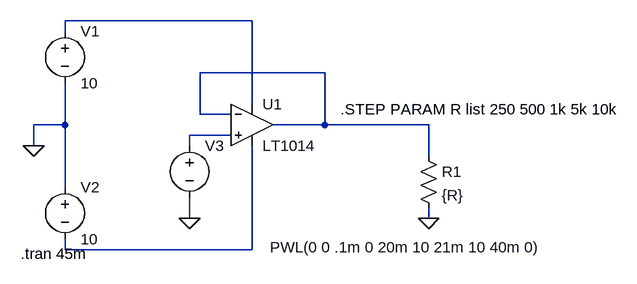
[diagram p0: schematic LT1014_output_drive.asc]
LT1014_output_drive.asc, the LTspice schematic file:
Version 4
SHEET 1 880 680
WIRE 208 0 -80 0
WIRE -80 16 -80 0
WIRE 320 80 128 80
WIRE 208 128 208 0
WIRE 128 144 128 80
WIRE 176 144 128 144
WIRE -80 160 -80 96
WIRE -80 160 -128 160
WIRE 320 160 320 80
WIRE 320 160 240 160
WIRE 480 160 320 160
WIRE 176 176 112 176
WIRE -128 192 -128 160
WIRE 112 192 112 176
WIRE 480 208 480 160
WIRE -80 256 -80 160
WIRE 112 304 112 272
WIRE 480 304 480 288
WIRE -80 352 -80 336
WIRE 208 352 208 192
WIRE 208 352 -80 352
FLAG -128 192 0
FLAG 480 304 0
FLAG 112 304 0
SYMBOL Opamps\\LT1014 208 96 R0
SYMATTR InstName U1
SYMBOL voltage -80 0 R0
WINDOW 123 0 0 Left 2
WINDOW 39 0 0 Left 2
SYMATTR InstName V1
SYMATTR Value 10
SYMBOL voltage -80 240 R0
WINDOW 123 0 0 Left 2
WINDOW 39 0 0 Left 2
SYMATTR InstName V2
SYMATTR Value 10
SYMBOL res 464 192 R0
SYMATTR InstName R1
SYMATTR Value {R}
SYMBOL voltage 112 176 R0
WINDOW 3 124 172 Left 2
WINDOW 123 0 0 Left 2
WINDOW 39 0 0 Left 2
SYMATTR InstName V3
SYMATTR Value PWL(0 0 .1m 0 20m 10 21m 10 40m 0)
TEXT -148 358 Left 2 !.tran 45m
TEXT 344 136 Left 2 !.STEP PARAM R list 250 500 1k 5k 10k

The netlist it stands for:
* LT1014_output_drive.asc
XU1 N003 N002 N001 N004 N002 LT1014  ; pins In+ In- V+ V- OUT
V1 N001 0 10
V2 0 N004 10
R1 N002 0 {R}
V3 N003 0 PWL(0 0 .1m 0 20m 10 21m 10 40m 0)
.tran 45m
.STEP PARAM R list 250 500 1k 5k 10k
.backanno
.end